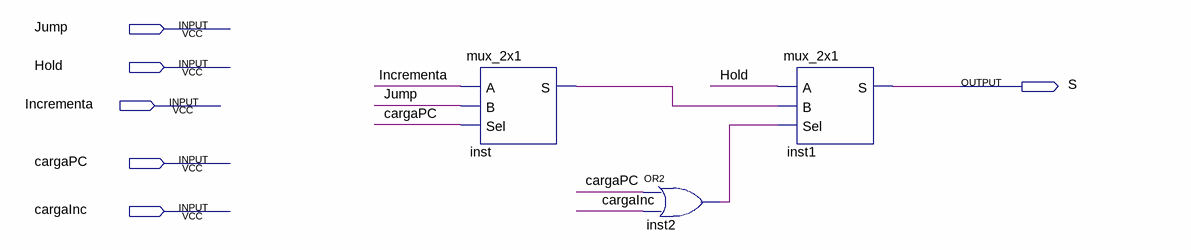
[diagram p0: schematic sheet]
// Quartus schematic mux_pc.bdf as structural Verilog: 3 symbols, 6 pins
module mux_pc (
  input  Jump,
  input  Hold,
  input  Incrementa,
  input  cargaPC,
  input  cargaInc,
  output S
);

  wire inst2_out, inst_s;

  mux_2x1 inst (.A(Incrementa), .B(Jump), .Sel(cargaPC), .S(inst_s));
  or inst2 (inst2_out, cargaPC, cargaInc);
  mux_2x1 inst1 (.A(Hold), .B(inst_s), .Sel(inst2_out), .S(S));
endmodule
